# EasyEDA Pro project ProPrj_Dolphin 3D.epro, schematic Schematic3
Create Date: 2024-07-03; Page Name: P1; Project Name: Dolphin 3D; Schematic Name: Schematic3; Update Date: 2024-07-03; Company: 嘉立创EDA; Page Size: A4; Version: V1.0
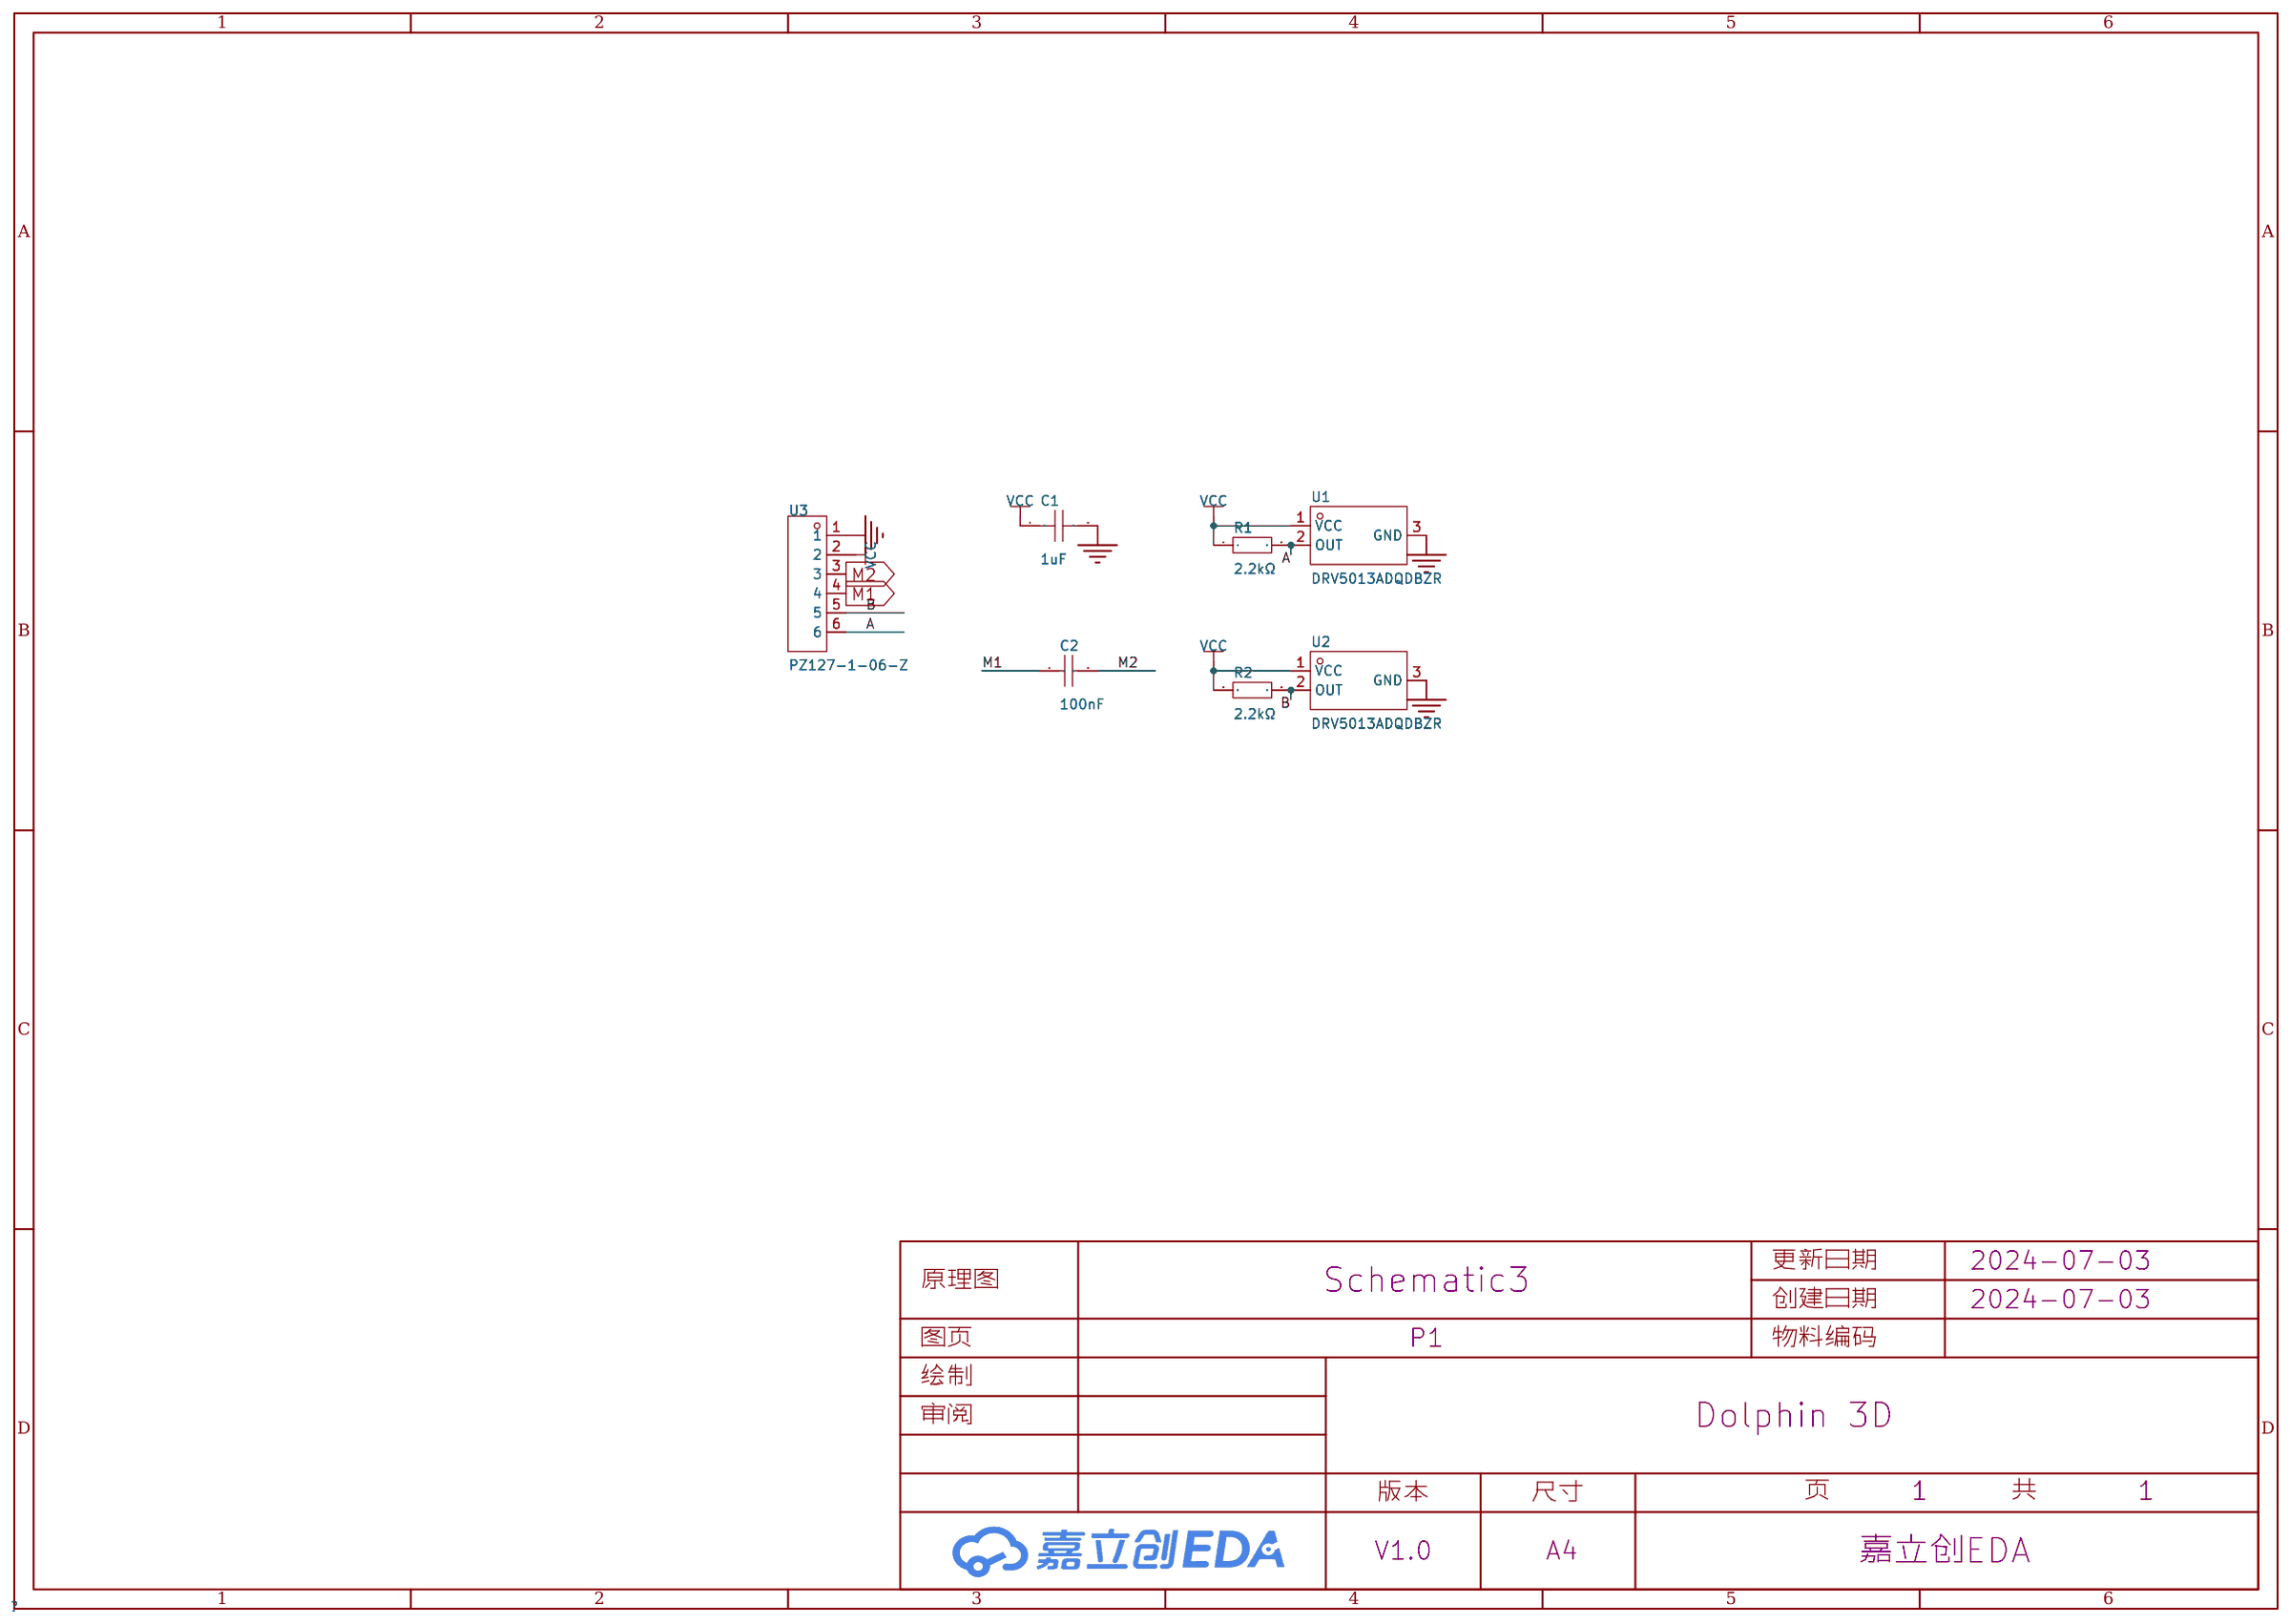
[diagram p2: schematic sheet]

## Parts
C1  1uF  [C0402]
C2  100nF  [C0402]
R1  2.2kΩ  [R0402]
R2  2.2kΩ  [R0402]
U1  DRV5013ADQDBZR  [SOT-23-3_L2.9-W1.3-P1.90-LS2.4-BR]
U2  DRV5013ADQDBZR  [SOT-23-3_L2.9-W1.3-P1.90-LS2.4-BR]
U3  PZ127-1-06-Z  [HDR-TH_6P-P1.27-V-M]

## Library data of the parts
C1 = CL05A105KA5NQNC: 容值:1uF;精度:±10%;额定电压:25V;材质(温度系数):X5R;; LCSC Part Name: 1uF ±10% 25V; Supplier Part: C52923; Manufacturer: SAMSUNG(三星); Supplier Footprint: 0402; JLCPCB Part Class: Basic Part; Datasheet: https://atta.szlcsc.com/upload/public/pdf/source/20160103/1457707735223.pdf; Supplier: LCSC; Tolerance: ±10%; Voltage Rated: 25V; Temperature Coefficient: X5R
C2 = CL05B104KB54PNC: 容值:100nF;精度:±10%;额定电压:50V;材质(温度系数):X7R;; LCSC Part Name: 100nF ±10% 50V; Supplier Part: C307331; Manufacturer: SAMSUNG(三星); Supplier Footprint: 0402; JLCPCB Part Class: Basic Part; Datasheet: https://atta.szlcsc.com/upload/public/pdf/source/20181009/C307331_222F7C870FD3EA5F46F538B483443886.pdf; Supplier: LCSC; Tolerance: ±10%; Voltage Rated: 50V; Temperature Coefficient: X7R
R1 R2 = 0402WGF2201TCE: 电阻类型:厚膜电阻;阻值:2.2kΩ;精度:±1%;功率:62.5mW;温度系数:±100ppm/℃;最大工作电压:50V;工作温度范围:-55℃~+155℃;; LCSC Part Name: 2.2kΩ ±1% 62.5mW; Supplier Part: C25879; Manufacturer: UNI-ROYAL(厚声); Supplier Footprint: 0402; JLCPCB Part Class: Basic Part; Datasheet: https://atta.szlcsc.com/upload/public/pdf/source/20200306/C422600_1E6D84923E4A46A82E41ADD87F860B5C.pdf; Supplier: LCSC; Type: 厚膜电阻; Tolerance: ±1%; Power(Watts): 62.5mW; Temperature Coefficient: ±100ppm/℃; Overload Voltage (Max): 50V; Operating Temperature Range: -55℃~+155℃
U1 U2 = DRV5013ADQDBZR: DRV5013 DRV5013 数字锁存霍尔 IC; LCSC Part Name: 数字锁存霍尔效应传感器; Supplier Part: C575585; Manufacturer: TI(德州仪器); Supplier Footprint: SOT-23-3; JLCPCB Part Class: Extended Part; Datasheet: https://atta.szlcsc.com/upload/public/pdf/source/20200601/C575585_CB3B3966E8A76DB15C34E6D4842F3BD0.pdf; Supplier: LCSC
U3 = PZ127-1-06-Z: 插针结构:1x6P;间距:1.27mm;行距:-;圆针/方针:方针;安装类型:直插;排数:单排;总PIN位数:6P;额定电流:1A;配合针长度:3.8mm;塑高:1mm;端接针长度:2.4mm;触头材质:黄铜;工作温度范围:-40℃~+105℃;焊接温度(最大值):260℃@10S;颜色:黑色;; LCSC Part Name: 1x6P 间距:1.27mm 方针 直插; Supplier Part: C5372829; Manufacturer: HCTL(华灿天禄); Supplier Footprint: 插件,P=1.27mm; JLCPCB Part Class: 扩展库; Datasheet: https://atta.szlcsc.com/upload/public/pdf/source/20240407/11460212CBFB9238DF6EEC00AAE28C4B.pdf; Supplier: LCSC; Pin Structure: 1x6P; Pitch: 1.27mm; Circluar Pins/Square Pins: 方针; Mounting Type: 直插; Number of Rows: 单排; Number of Pins: 6P; Current Rating (Max): 1A; Length of Mating Pin: 3.8mm; Insulation Height: 1mm; Length of End Connection Pin: 2.4mm; Contact Material: 黄铜; Operating Temperature Range: -40℃~+105℃; Soldering Temperature(Max): 260℃@10S; Color: 黑色

## Nets
GND: C1.2 U1.3(GND) U2.3(GND) U3.1
VCC: C1.1 R1.1 R2.1 U1.1(VCC) U2.1(VCC) U3.2
A: R1.2 U1.2(OUT) U3.6
B: R2.2 U2.2(OUT) U3.5
M1: C2.1 U3.4
M2: C2.2 U3.3
